# EAGLE schematic schematic (EAGLE 6.5.0)
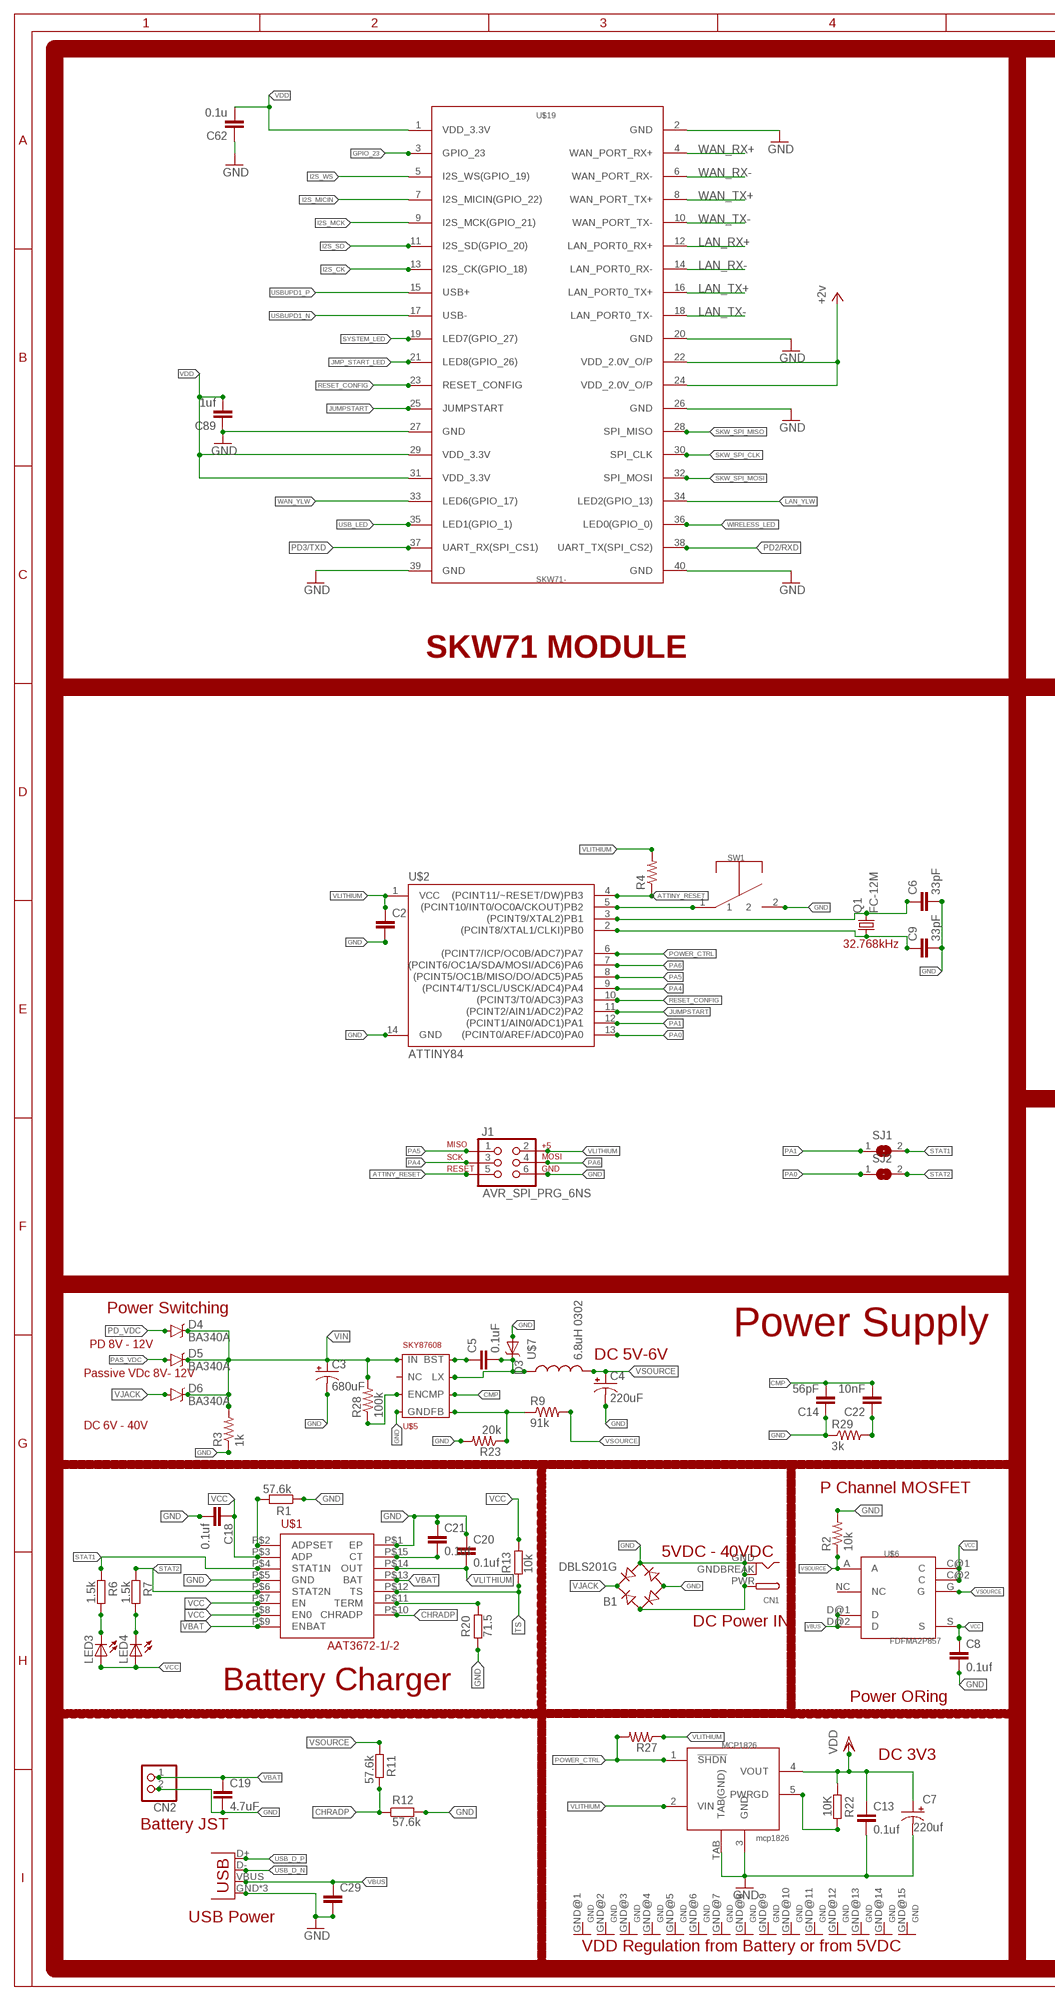
[diagram p0: schematic, sheet 1, part 1 of 2]
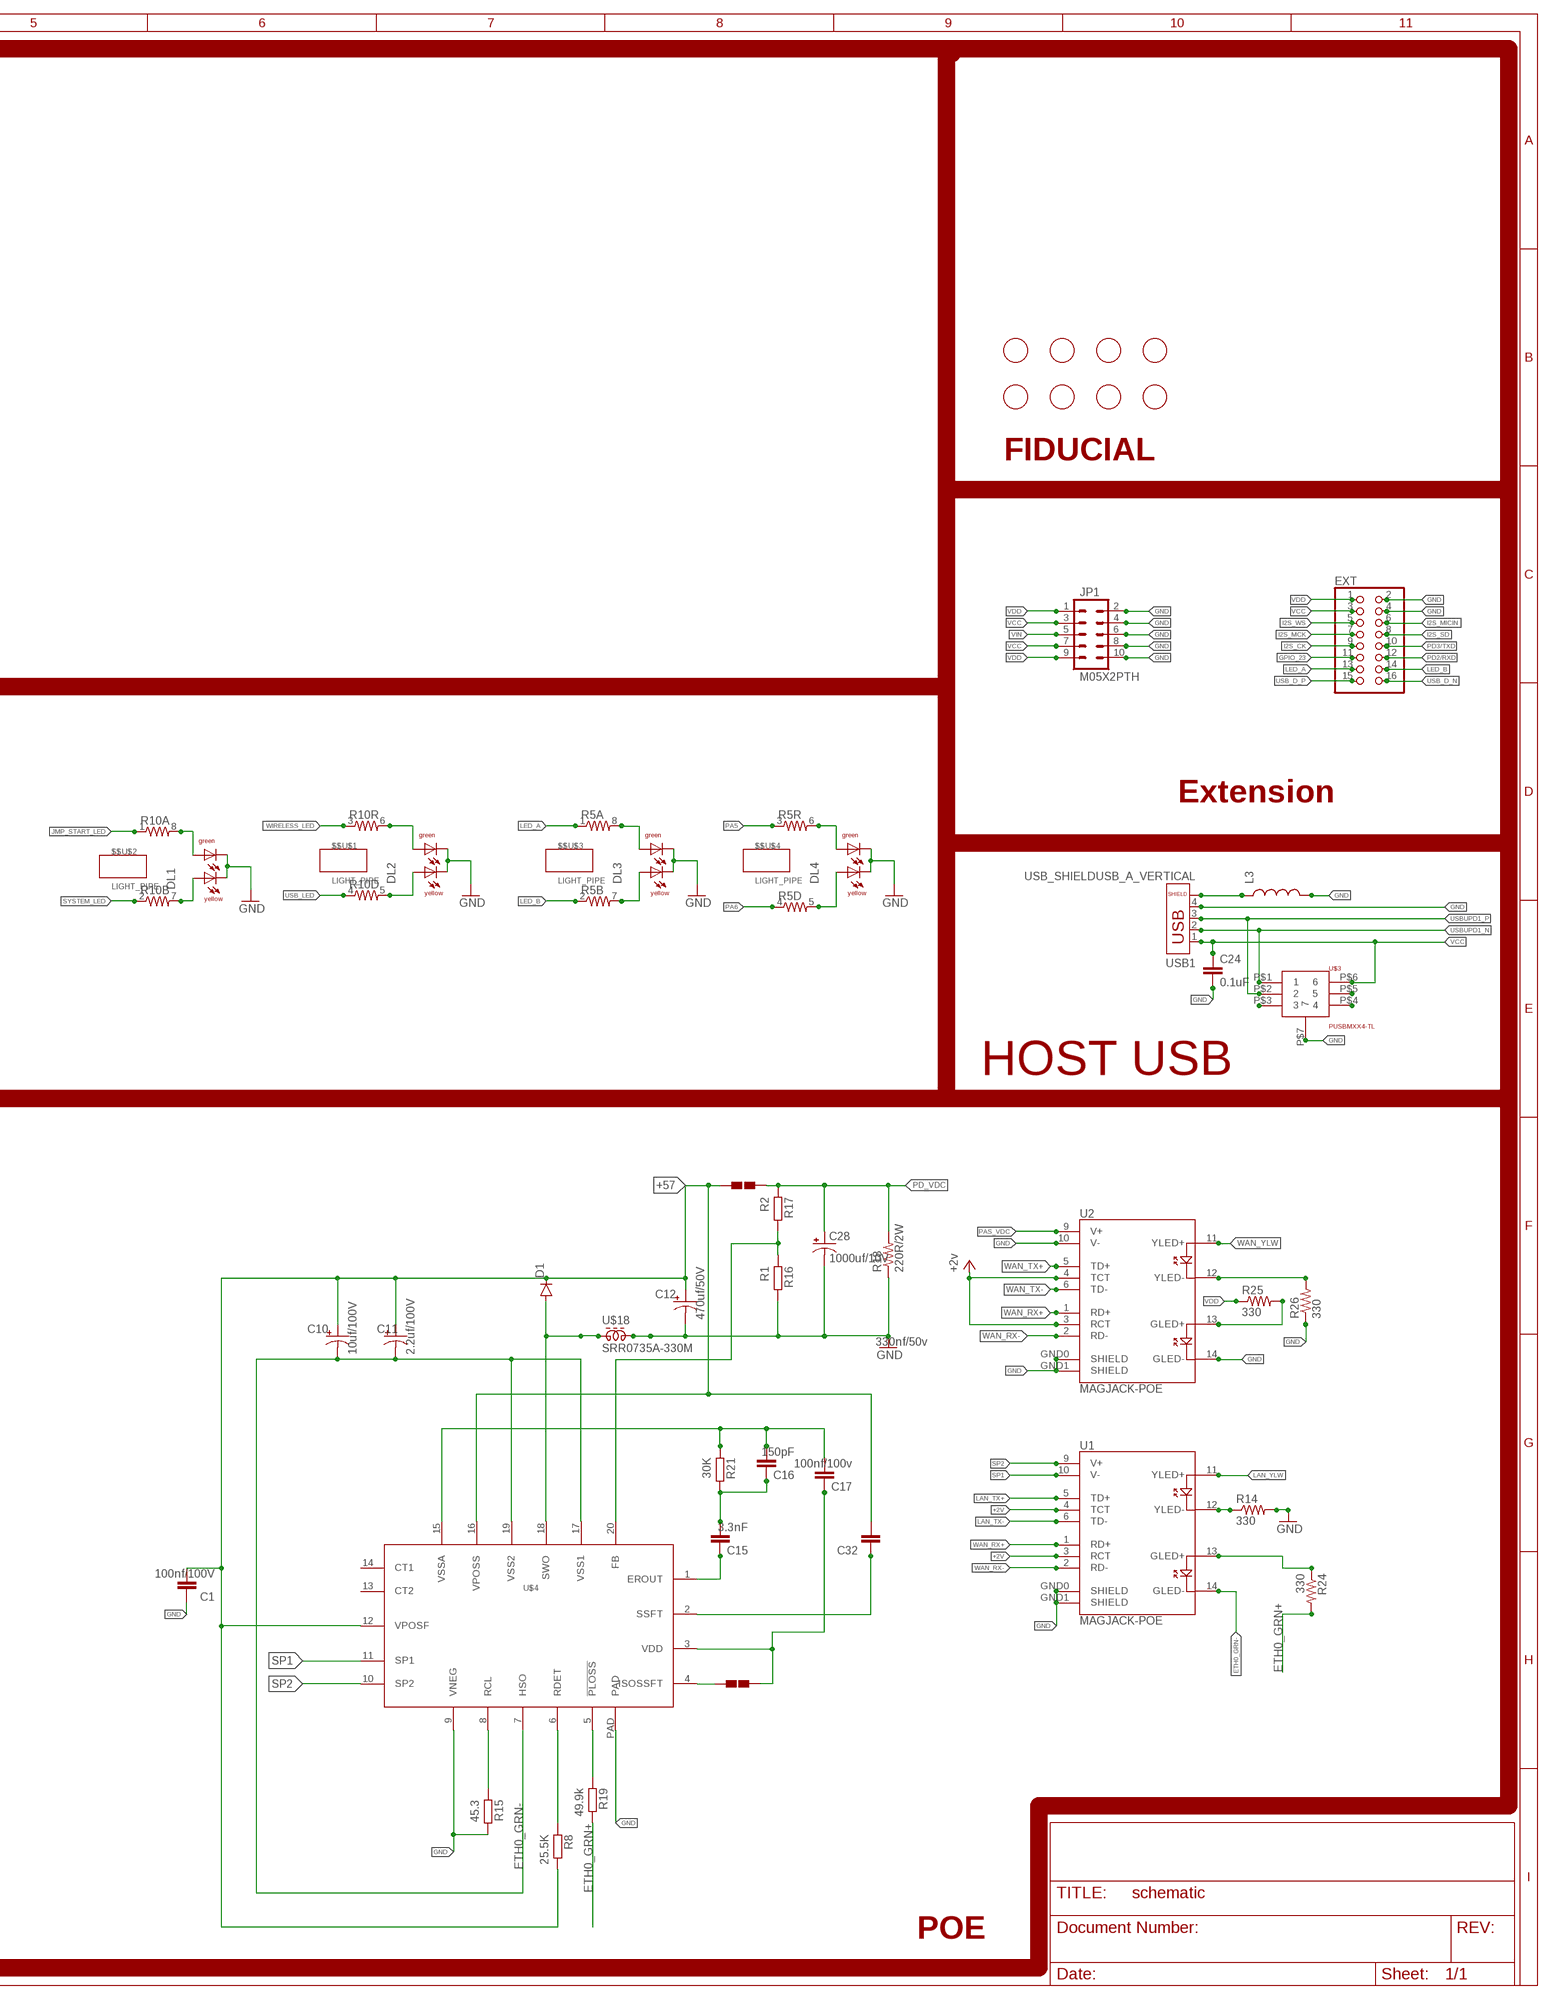
[diagram p1: schematic, sheet 1, part 2 of 2]

## Parts
$$U$1  LIGHT_PIPE  [LIGHT-PIPE]
$$U$2  LIGHT_PIPE  [LIGHT-PIPE]
$$U$3  LIGHT_PIPE  [LIGHT-PIPE]
$$U$4  LIGHT_PIPE  [LIGHT-PIPE]
B1  DBLS201G  [DBS]
C1  100nf/100V  C-EUC0805  [C0805]
C2  CAP0402-CAP  [0402-CAP]
C3  680uF  CPOL-USE3.5-10  [E3,5-10]
C4  220uF  CPOL-USE5-10.5  [E5-10,5]
C5  0.1uF  CAP0402-CAP  [0402-CAP]
C6  33pF  CAP0402-CAP  [0402-CAP]
C7  220uf  CPOL-USE5-10.5  [E5-10,5]
C8  0.1uf  C-EUC0402  [C0402]
C9  33pF  CAP0402-CAP  [0402-CAP]
C10  10uf/100V  CPOL-USE2,5-6E  [E2,5-6E]
C11  2.2uf/100V  CPOL-USE2-5  [E2-5]
C12  470uf/50V  CPOL-USE5-10.5  [E5-10,5]
C13  0.1uf  C-EUC0402  [C0402]
C14  56pF  CAP0402-CAP  [0402-CAP]
C15  3.3nF  C-EUC0805  [C0805]
C16  150pF  C-EUC0805  [C0805]
C17  100nf/100v  C-EUC0805  [C0805]
C18  0.1uf  C-EUC0402  [C0402]
C19  4.7uF  C-EUC0402  [C0402]
C20  0.1uf  C-EUC0402  [C0402]
C21  0.1uf  C-EUC0402  [C0402]
C22  10nF  CAP0402-CAP  [0402-CAP]
C24  0.1uF  CAP0402-CAP  [0402-CAP]
C28  1000uf/10V  CPOL-USE5-13  [E5-13]
C29  CAP0402-CAP  [0402-CAP]
C32  330nf/50v  C-EUC0805  [C0805]
C62  0.1u  CAPACITOR  [C0603]
C89  1uf  CAPACITOR  [C0603]
CN1  DCBARRELPTH  [DCJACK_2MM_PTH]
CN2  JST_2PIN-THM  [JST-PH-2-THM]
D1  DIODESMC/DO-214AB  [SMC]
D3  DIODE-SCHOTTKY_  [SMA-DIODE]
D4  BA340A  B340A  [SMA-DIODE]
D5  BA340A  B340A  [SMA-DIODE]
D6  BA340A  B340A  [SMA-DIODE]
DL1  DUOLED-1X2  [DUOLED-C-0603]
DL2  DUOLED-1X2  [DUOLED-C-0603]
DL3  DUOLED-1X2  [DUOLED-C-0603]
DL4  DUOLED-1X2  [DUOLED-C-0603]
EXT  PINHD-2X8  [2X08]
J1  AVR_SPI_PRG_6NS  [2X3-NS]
JP1  M05X2PTH  [AVR_ICSP]
JP4  USB-MICROB  [USB-MICROB]
L3  INDUCTOR0402  [C0402]
LED3  LEDCHIP-LED0603  [CHIP-LED0603]
LED4  LEDCHIP-LED0603  [CHIP-LED0603]
MCP1826  mcp1826  MCP1825T  [SOT223-5]
Q1  FC-12M  [FC-12M]
R1  57.6k  R-EU_R0402  [R0402]
R2  10k  RESISTOR0402-RES  [0402-RES]
R3  1k  RESISTOR0402-RES  [0402-RES]
R4  RESISTOR0402-RES  [0402-RES]
R5  RESISTOR-ARRAY0603-ARV  [0603-ARV]
R6  1.5k  R-EU_R0402  [R0402]
R7  1.5k  R-EU_R0402  [R0402]
R8  25.5K  RESISTOR  [R0603]
R9  91k  RESISTOR0402-RES  [0402-RES]
R10  RESISTOR-ARRAY0603-ARV  [0603-ARV]
R11  57.6k  R-EU_R0402  [R0402]
R12  57.6k  R-EU_R0402  [R0402]
R13  10k  R-EU_R0402  [R0402]
R14  330  RESISTOR0402-RES  [0402-RES]
R15  45.3  RESISTOR  [R0603]
R16  R1  RESISTOR  [R0603]
R17  R2  RESISTOR  [R0603]
R18  220R/2W  R-US_R2512  [R2512]
R19  49.9k  RESISTOR  [R0603]
R20  71.5  R-EU_R0402  [R0402]
R21  30K  RESISTOR  [R0603]
R22  10K  R-EU_R0402  [R0402]
R23  20k  RESISTOR0402-RES  [0402-RES]
R24  330  RESISTOR0402-RES  [0402-RES]
R25  330  RESISTOR0402-RES  [0402-RES]
R26  330  RESISTOR0402-RES  [0402-RES]
R27  RESISTOR0402-RES  [0402-RES]
R28  100k  RESISTOR0402-RES  [0402-RES]
R29  3k  RESISTOR0402-RES  [0402-RES]
SJ1  JUMPER  [SJW]
SJ2  JUMPER  [SJW]
SW1  TACTILE-2PIN'  [TACTILE-2PIN-RTANGLE]
U1  MAGJACK-POE  [MAGJACK-POE]
U2  MAGJACK-POE  [MAGJACK-POE]
U$1  AAT3672-1/-2  [AAT3672-1/-2]
U$2  ATTINY84  [SO14]
U$3  PUSBMXX4-TL  [PUSBMXX4-TL]
U$4  SI3402  [SI3402]
U$5  SKY87608  [8PIN-SOP-8L-EP]
U$6  FDFMA2P857  [6-WDFN-EXPOSED-PAD]
U$7  6.8uH 0302  INDUCTOR_0302  [0302]
U$9  FIDUCIAL  [FIDUCIAL_1MM]
U$10  SOL-PAD-OPEN  [SOL-PAD-OPEN]
U$11  FIDUCIAL  [FIDUCIAL_1MM]
U$12  FIDUCIAL  [FIDUCIAL_1MM]
U$13  FIDUCIAL  [FIDUCIAL_1MM]
U$14  FIDUCIAL  [FIDUCIAL_1MM]
U$15  FIDUCIAL  [FIDUCIAL_1MM]
U$16  FIDUCIAL  [FIDUCIAL_1MM]
U$17  FIDUCIAL  [FIDUCIAL_1MM]
U$18  SRR0735A-330M  [SRR0735A-330M]
U$19  SKW71-  [SKW71-SMT]
U$28  SOL-PAD-OPEN  [SOL-PAD-OPEN]
USB1  USB_SHIELDUSB_A_VERTICAL  [USB_A_VERTICAL_PTH]

## Nets
+2V [power]: U1.3(RCT) U1.4(TCT) U2.3(RCT) U2.4(TCT) U$19.22(VDD_2.0V_O/P) U$19.24(VDD_2.0V_O/P) ; supply symbol labelled +2v
+57 [power]: C1.2 C10.+ C11.+ C12.+ C32.2 D1.C R8.2 U$4.12(VPOSF) U$4.16(VPOSS) U$28.P$1
ATTINY_RESET: J1.5 R4.1 U$2.4((PCINT11/~RESET/DW)PB3)
CHRADP: R11.2 R12.1 U$1.P$10(CHRADP)
CMP: C14.2 C22.2 U$5.P$6(CMP)
ETH0_GRN+: R19.2 R24.2
ETH0_GRN-: C10.- C11.- U1.14(GLED-) U$4.7(HSO) U$4.17(VSS1) U$4.19(VSS2)
GND: B1.- B1.AC2 C1.1 C2.2 C3.- C4.- C6.2 C7.- C8.2 C9.2 C12.- C13.2 C14.1 C18.2 C19.2 C20.1 C21.1 C24.2 C28.- C29.2 C62.1 C89.1 CN1.GND CN1.GNDBREAK CN2.2 D3.A DL1.C1 DL1.C2 DL2.C1 DL2.C2 DL3.C1 DL3.C2 DL4.C1 DL4.C2 EXT.2 EXT.4 J1.6 JP1.2 JP1.4 JP1.6 JP1.8 JP1.10 JP4.GND JP4.MT1(GND) JP4.MT2(GND) L3.2 MCP1826.3(GND) MCP1826.TAB(TAB(GND)) R1.1 R2.2 R3.1 R12.2 R14.2 R15.2 R16.2 R18.1 R20.1 R23.2 R26.1 R29.1 SW1.2 U1.GND0(SHIELD) U1.GND1(SHIELD) U2.10(V-) U2.14(GLED-) U2.GND0(SHIELD) U2.GND1(SHIELD) U$1.P$1(EP) U$1.P$5(GND) U$2.14(GND) U$3.P$7 U$4.9(VNEG) U$4.PAD U$5.P$4(GND) U$18.P$2 U$19.2(GND) U$19.20(GND) U$19.26(GND) U$19.27(GND) U$19.39(GND) U$19.40(GND) USB1.4
GPIO_23: EXT.11 U$19.3(GPIO_23)
I2S_CK: EXT.9 U$19.13(I2S_CK(GPIO_18))
I2S_MCK: EXT.7 U$19.9(I2S_MCK(GPIO_21))
I2S_MICIN: EXT.6 U$19.7(I2S_MICIN(GPIO_22))
I2S_SD: EXT.8 U$19.11(I2S_SD(GPIO_20))
I2S_WS: EXT.5 U$19.5(I2S_WS(GPIO_19))
JMP_START_LED: R10.1 U$19.21(LED8(GPIO_26))
JUMPSTART: U$2.11((PCINT2/AIN1/ADC2)PA2) U$19.25(JUMPSTART)
LAN_RX+: U$19.12(LAN_PORT0_RX+)
LAN_RX-: U$19.14(LAN_PORT0_RX-)
LAN_TX+: U1.5(TD+) U$19.16(LAN_PORT0_TX+)
LAN_TX-: U1.6(TD-) U$19.18(LAN_PORT0_TX-)
LAN_YLW: U1.11(YLED+) U$19.34(LED2(GPIO_13))
LED_A: EXT.13 R5.1
LED_B: EXT.14 R5.2
N$1: DL2.A1 R10.6
N$2: C5.2 D3.C U$5.P$2(LX) U$7.P$1
N$3: DL1.A1 R10.8
N$4: DL2.A2 R10.5
N$5: R1.2 U$1.P$2(ADPSET)
N$6: C16.2 C17.2 R21.1 U$4.15(VSSA)
N$7: C15.2 C16.1 R21.2
N$8: R8.1 U$4.6(RDET)
N$9: R15.1 U$4.8(RCL)
N$11: U$4.4(ISOSSFT) U$10.P$1
N$12: C17.1 U$4.3(VDD) U$10.P$2
N$13: C15.1 U$4.1(EROUT)
N$14: C6.1 Q1.2 U$2.3((PCINT9/XTAL2)PB1)
N$15: C32.1 U$4.2(SSFT)
N$16: R16.1 R17.2 U$4.20(FB)
N$17: DL3.A2 R5.7
N$18: R19.1 U$4.5(!PLOSS)
N$19: DL4.A1 R5.6
N$20: MCP1826.5(PWRGD) R22.2
N$21: C9.1 Q1.1 U$2.2((PCINT8/XTAL1/CLKI)PB0)
N$22: R28.1 U$5.P$7(EN)
N$23: U2.11(YLED+)
N$24: R14.1 U1.12(YLED-)
N$25: R25.2 U2.13(GLED+)
N$26: C5.1 U$5.P$8(BST)
N$27: R9.1 R23.1 U$5.P$5(FB)
N$29: DL4.A2 R5.5
N$30: SW1.1 U$2.5((PCINT10/INT0/OC0A/CKOUT)PB2)
N$31: R26.2 U2.12(YLED-)
N$32: U$3.P$3
N$33: U$3.P$4
N$34: U$3.P$5
N$35: DL3.A1 R5.8
N$36: R20.2 U$1.P$11(TERM)
N$37: C22.1 R29.2
N$38: D1.A U$4.18(SWO) U$18.P$1
N$40: DL1.A2 R10.7
N$41: L3.1 USB1.P$3
N$42: C21.2 U$1.P$15(CT)
N$44: B1.AC1 CN1.PWR
N$47: LED4.C R7.2
N$48: LED3.C R6.2
N$95: R24.1 U1.13(GLED+)
PA0: SJ2.1 U$2.13((PCINT0/AREF/ADC0)PA0)
PA1: SJ1.1 U$2.12((PCINT1/AIN0/ADC1)PA1)
PA4: J1.3 U$2.9((PCINT4/T1/SCL/USCK/ADC4)PA4)
PA5: J1.1 R5.3 U$2.8((PCINT5/OC1B/MISO/DO/ADC5)PA5)
PA6: J1.4 R5.4 U$2.7((PCINT6/OC1A/SDA/MOSI/ADC6)PA6)
PAS_VDC: D5.A U2.9(V+)
PD2/RXD: EXT.12 U$19.38(UART_TX(SPI_CS2))
PD3/TXD: EXT.10 U$19.37(UART_RX(SPI_CS1))
PD_VDC: C28.+ D4.A R17.1 R18.2 U$28.P$2
POWER_CTRL: MCP1826.1(!SHDN) R27.2 U$2.6((PCINT7/ICP/OC0B/ADC7)PA7)
RESET_CONFIG: U$2.10((PCINT3/T0/ADC3)PA3) U$19.23(RESET_CONFIG)
SKW_SPI_CLK: U$19.30(SPI_CLK)
SKW_SPI_MISO: U$19.28(SPI_MISO)
SKW_SPI_MOSI: U$19.32(SPI_MOSI)
SP1: U1.10(V-) U$4.11(SP1)
SP2: U1.9(V+) U$4.10(SP2)
STAT1: R6.1 SJ1.2 U$1.P$4(STAT1N)
STAT2: R7.1 SJ2.2 U$1.P$6(STAT2N)
SYSTEM_LED: R10.2 U$19.19(LED7(GPIO_27))
TS: R13.1 U$1.P$12(TS)
USB_D_N: EXT.16 JP4.D-
USB_D_P: EXT.15 JP4.D+
USB_LED: R10.4 U$19.35(LED1(GPIO_1))
USBUPD1_N: U$3.P$1 U$19.17(USB-) USB1.2
USBUPD1_P: U$3.P$2 U$19.15(USB+) USB1.3
VBAT: C19.1 CN2.1 U$1.P$9(ENBAT) U$1.P$13(BAT)
VBUS: C29.1 JP4.VBUS U$6.D@1(D) U$6.D@2(D)
VCC: C8.1 C18.1 C24.1 EXT.3 JP1.3 JP1.7 LED3.A LED4.A R13.2 U$1.P$3(ADP) U$1.P$7(EN) U$1.P$8(EN0) U$3.P$6 U$6.C@1(C) U$6.C@2(C) U$6.S USB1.1
VDD: C7.+ C13.1 C62.2 C89.2 EXT.1 JP1.1 JP1.9 MCP1826.4(VOUT) R22.1 R25.1 U$19.1(VDD_3.3V) U$19.29(VDD_3.3V) U$19.31(VDD_3.3V)
VIN: C3.+ D4.C D5.C D6.C JP1.5 R3.2 R28.2 U$5.P$1(IN)
VJACK: B1.+ D6.A
VLITHIUM: C2.1 C20.2 J1.2 MCP1826.2(VIN) R4.2 R27.1 U$1.P$14(OUT) U$2.1(VCC)
VSOURCE: C4.+ R2.1 R9.2 R11.1 U$6.A U$6.G U$7.P$2
WAN_RX+: U1.1(RD+) U2.1(RD+) U$19.4(WAN_PORT_RX+)
WAN_RX-: U1.2(RD-) U2.2(RD-) U$19.6(WAN_PORT_RX-)
WAN_TX+: U2.5(TD+) U$19.8(WAN_PORT_TX+)
WAN_TX-: U2.6(TD-) U$19.10(WAN_PORT_TX-)
WAN_YLW: U$19.33(LED6(GPIO_17))
WIRELESS_LED: R10.3 U$19.36(LED0(GPIO_0))
Unconnected: U$4.13(CT2) U$4.14(CT1) U$5.P$3(NC) U$6.NC

## Notes on the sheet
- FIDUCIAL
- SKW71 MODULE
- Extension
- 32.768kHz
- HOST USB
- Power Switching
- Power Supply
- PD 8V - 12V
- DC 5V-6V
- Passive VDc 8V- 12V
- DC 6V - 40V
- P Channel MOSFET
- 5VDC - 40VDC
- DC Power IN
- Battery Charger | Power ORing
- DC 3V3
- Battery JST
- USB Power
- VDD Regulation from Battery or from 5VDC | POE

## Power pins joined to a net without a drawn wire
GND: MCP1826.GND@1(GND) MCP1826.GND@2(GND) MCP1826.GND@3(GND) MCP1826.GND@4(GND) MCP1826.GND@5(GND) MCP1826.GND@6(GND) MCP1826.GND@7(GND) MCP1826.GND@8(GND) MCP1826.GND@9(GND) MCP1826.GND@10(GND) MCP1826.GND@11(GND) MCP1826.GND@12(GND) MCP1826.GND@13(GND) MCP1826.GND@14(GND) MCP1826.GND@15(GND)

## Library data of the parts
$$U$1-$$U$4 = BaseApp:LIGHT_PIPE: Digikey No :- __492-1313-ND__
B1 = rectifier:DB?*G: Single Phase 1.0 AMP Glass Passivated Bridge Rectifier Taiwan Semiconductor Co.,Ltd. - TSC Source: http://www.taiwansemi.com/TSCbig5/ezcatfiles/cust/img/img/db101g.pdf http://www.ts.com.tw/db/pictures/modules/PDT/PDT060207001/DBLS201G.pdf
C1 C8 C13 C15-C21 C32 = rcl:C-EU: CAPACITOR, European symbol
C2 = SparkFun-Passives:CAP: Capacitor Standard 0603 ceramic capacitor, and 0.1" leaded capacitor.
C3 C4 = schematic:CPOL-US: POLARIZED CAPACITOR, American symbol
C5 C6 C9 C14 C22 C24 C29 = SparkFun-Capacitors:CAP: Capacitor Standard 0603 ceramic capacitor, and 0.1" leaded capacitor.
C7 C11 C28 = adafruit:CPOL-US: POLARIZED CAPACITOR, American symbol
C10 C12 = adafruit2:CPOL-US: POLARIZED CAPACITOR, American symbol
C62 C89 = BaseApp:CAPACITOR: C0402 & C0603 are general chip capacitors Film Capacitor, 400V's Mouser Part No :- __ECQ-E4474KF__
CN1 = adafruit:DCBARREL: 2.0mm DC Barrel Jack DCJACK_2MM_PTH - Through Hole Jack (4UConnector: 05537)
CN2 = adafruit:JST_2PIN: JST 2-Pin Connectors of various flavors SMT-RA (S2B-PH-SM4) 4UConnector #17311 SMT (B2B-PH-SM4) THM-RA (S2B-PH) THM (B2B-PH)
D1 = SparkFun-DiscreteSemi:DIODE: Diode These are standard reverse protection diodes and small signal diodes. SMA package can handle up to about 1A. SOD-323 can handle about 200mA. What the SOD-323 package when ordering, there are some mfgs out there that are 5-pin packages.
D3 = schematic:DIODE-SCHOTTKY
D4-D6 = SparkFun-DiscreteSemi:B340A: Schottky Diode 3A-40V; PROD_ID: DIO-09886
DL1-DL4 = BaseApp:DUOLED-1X2: Digikey No :- __754-1146-1-ND__
EXT = pinhead:PINHD-2X8: PIN HEADER
J1 = SparkFun-Connectors:AVR_SPI_PRG_6: AVR ISP 6 Pin This is the reduced ISP connector for AVR programming. Common on Arduino. This footprint will take up less PCB space and can be used with a 10-pin to 6-pin adapter such as SKU: BOB-08508 **Special note about "TEST_POINT" package. The stop mask is on the top side, so if you want your programming test points to be on the bottom of your board, make sure to place this package on the bottom side of the board. This also ensure that the orientation to program from the bottom side will be correct.
JP1 = SparkFun-Connectors:M05X2: Header 5x2 Standard 10-pin dual row 0.1" header. Commonly used with AVR-ISP. Use with Spark Fun Electronics SKU: PRT-00778
JP4 = SparkFun-Connectors:USB: USB Connectors USB-B-PTH is fully proven SKU : PRT-00139/CONN-08278 USB-miniB is fully proven SKU : PRT-00587 USB-A-PCB is untested. USB-A-H is throughly reviewed, but untested. Spark Fun Electronics SKU : PRT-00437 USB-B-SMT is throughly reviewed, but untested. Needs silkscreen touching up. USB-A-S has not been used/tested USB-MB-H has not been used/tested USB-MICROB has been used. CONN-09505; PROD_ID: CONN-09505
L3 = SparkFun-Passives:INDUCTOR: Inductors Basic Inductor/Choke - 0603 and 1206. Footprints are not proven and vary greatly between part numbers. SRN6045- 33uH, 20% 1.4A SDR0403-560KL - 56uH, 10%, 500mA RMS/740mA peak
LED3 LED4 = led:LED: LED OSRAM: - CHIPLED LG R971, LG N971, LY N971, LG Q971, LY Q971, LO R971, LY R971 LH N974, LH R974 LS Q976, LO Q976, LY Q976 LO Q996 - Hyper CHIPLED LW Q18S LB Q993, LB Q99A, LB R99A - SideLED LS A670, LO A670, LY A670, LG A670, LP A670 LB A673, LV A673, LT A673, LW A673 LH A674 LY A675 LS A676, LA A676, LO A676, LY A676, LW A676 LS A679, LY A679, LG A679 - Hyper Micro SIDELED® LS Y876, LA Y876, LO Y876, LY Y876 LT Y87S - SmartLED LW L88C, LW L88S LB L89C, LB L89S, LG L890 LS L89K, LO L89K, LY L89K LS L896, LA L896, LO L896, LY L896 - TOPLED LS T670, LO T670, LY T670, LG T670, LP T670 LSG T670, LSP T670, LSY T670, LOP T670, LYG T670 LG T671, LOG T671, LSG T671 LB T673, LV T673, LT T673, LW T673 LH T674 LS T676, LA T676, LO T676, LY T676, LB T676, LH T676, LSB T676, LW T676 LB T67C, LV T67C, LT T67C, LS T67K, LO T67K, LY T67K, LW E67C LS E67B, LA E67B, LO E67B, LY E67B, LB E67C, LV E67C, LT E67C LW T67C LS T679, LY T679, LG T679 LS T770, LO T770, LY T770, LG T770, LP T770 LB T773, LV T773, LT T773, LW T773 LH T774 LS E675, LA E675, LY E675, LS T675 LS T776, LA T776, LO T776, LY T776, LB T776 LHGB T686 LT T68C, LB T68C - Hyper Mini TOPLED® LB M676 - Mini TOPLED Santana® LG M470 LS M47K, LO M47K, LY M47K Source: http://www.osram.convergy.de LUXEON: - LUMILED® LXK2-PW12-R00, LXK2-PW12-S00, LXK2-PW14-U00, LXK2-PW14-V00 LXK2-PM12-R00, LXK2-PM12-S00, LXK2-PM14-U00 LXK2-PE12-Q00, LXK2-PE12-R00, LXK2-PE12-S00, LXK2-PE14-T00, LXK2-PE14-U00 LXK2-PB12-K00, LXK2-PB12-L00, LXK2-PB12-M00, LXK2-PB14-N00, LXK2-PB14-P00, LXK2-PB14-Q00 LXK2-PR12-L00, LXK2-PR12-M00, LXK2-PR14-Q00, LXK2-PR14-R00 LXK2-PD12-Q00, LXK2-PD12-R00, LXK2-PD12-S00 LXK2-PH12-R00, LXK2-PH12-S00 LXK2-PL12-P00, LXK2-PL12-Q00, LXK2-PL12-R00 Source: www.luxeon.com KINGBRIGHT: KA-3528ASYC Source: www.kingbright.com
MCP1826 = BaseApp:MCP1825T: Digikey No:- __MCP1825T-5002E/DCCT-ND__
Q1 = crystal:FC-12M: kHz RANGE CRYSTAL UNIT LOW PROFILE SMD Source: Epson Toyocom FC-12M.pdf
R1 R6 R7 R11-R13 R20 R22 = resistor:R-EU_: RESISTOR, European symbol
R2-R4 R9 R14 R23-R29 = SparkFun-Passives:RESISTOR: Resistor Basic schematic elements and footprints for 0603, 1206, and PTH resistors.
R5 R10 = SparkFun-Resistors:RESISTOR-ARRAY: Array Chip Resistor Source: RS Component / Phycomp
R8 R15-R17 R19 R21 = BaseApp:RESISTOR: Resistance Package :- 0603 Mount :-Surface mount
R18 = adafruit:R-US_: RESISTOR, American symbol
SJ1 SJ2 = BaseApp:JUMPER
SW1 = BaseApp:TACTILE-2PIN: Digikey No. :- 450-1758-1-ND
U1 U2 = SparkFun-Connectors:MAGJACK-POE: PoE compatible MagJack
U$1 = schematic:AAT3672-1/-2
U$2 = SparkFun-DigitalIC:ATTINY84: Atmel 14-pin 2/4/8kB flash uC
U$3 = schematic:PUSBMXX4-TL
U$4 = BaseApp:SI3402: FULLY-INTEGRATED 802.3-COMPLIANT POE PD INTERFACE AND LOW-EMI SWITCHING REGULATOR
U$5 = schematic:SKY87608
U$6 = BaseApp:FDFMA2P857
U$7 = schematic:INDUCTOR_0302
U$9 U$11-U$17 = adafruit:FIDUCIAL: For use by pick and place machines to calibrate the vision/machine, 1mm By microbuilder.eu
U$10 U$28 = BaseApp:SOL-PAD-OPEN
U$18 = schematic:SRR0735A-330M
U$19 = BaseApp:SKW71
USB1 = schematic:USB_SHIELD

## Net classes
0 default: width 0.152 mm, drill 0.305 mm, clearance 0.152 mm
1 power: width 0.152 mm, drill 0.305 mm, clearance 0.152 mm
2 gnd: width 0.152 mm, drill 0.305 mm, clearance 0.152 mm